# EAGLE design Motor_Controller (EAGLE 7.7.0)
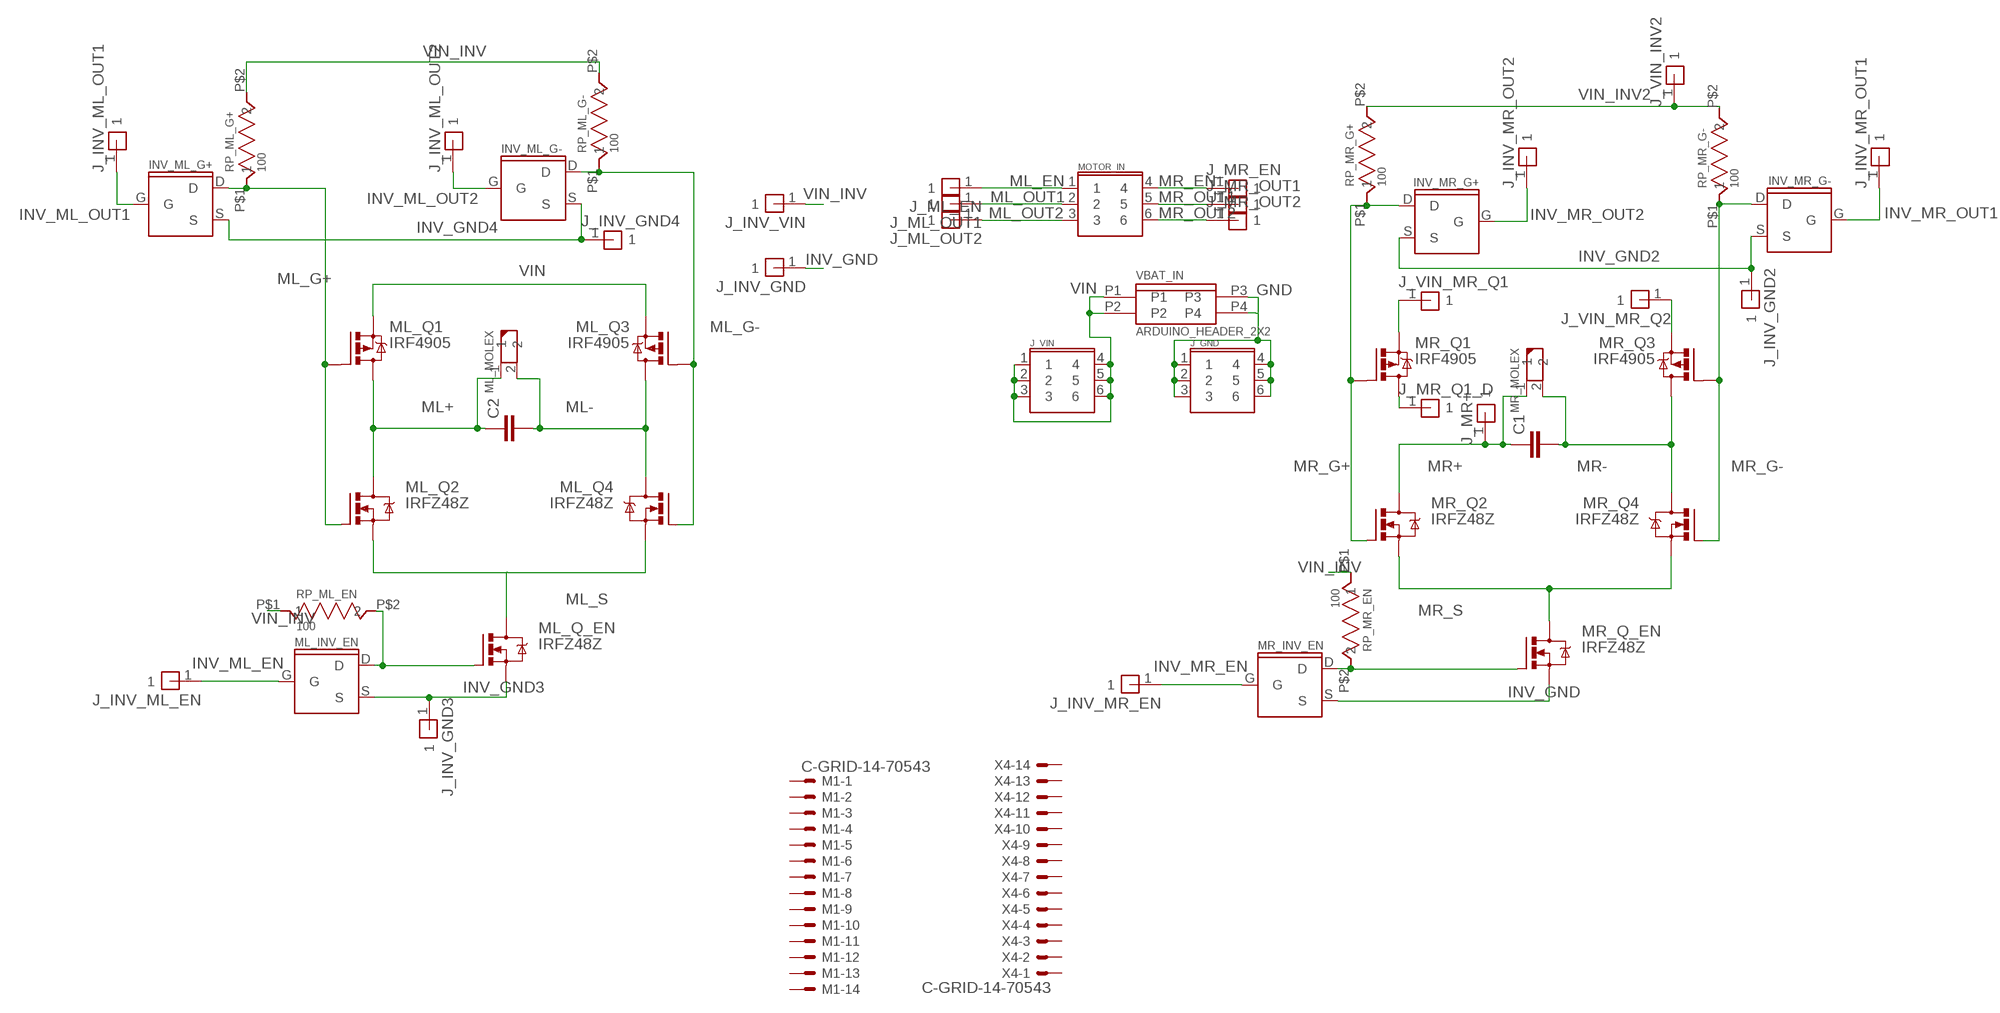
[diagram p0: schematic, sheet 1]

## Parts
C1  C5/3  [C5B3]
C2  C5/3  [C5B3]
INV_ML_G+  2N7000  [TO-92]
INV_ML_G-  2N7000  [TO-92]
INV_MR_G+  2N7000  [TO-92]
INV_MR_G-  2N7000  [TO-92]
J_GND  ARDUINO_HEADER_3X2  [ARDUINO_HEADER_3X2]
J_INV_GND  ARDUINO_HEADER_1X1_OCTAGON  [ARDUINO_HEADER_1X1_OCTAGON]
J_INV_GND2  ARDUINO_HEADER_1X1_OCTAGON  [ARDUINO_HEADER_1X1_OCTAGON]
J_INV_GND3  ARDUINO_HEADER_1X1_OCTAGON  [ARDUINO_HEADER_1X1_OCTAGON]
J_INV_GND4  ARDUINO_HEADER_1X1_OCTAGON  [ARDUINO_HEADER_1X1_OCTAGON]
J_INV_ML_EN  ARDUINO_HEADER_1X1_OCTAGON  [ARDUINO_HEADER_1X1_OCTAGON]
J_INV_ML_OUT1  ARDUINO_HEADER_1X1_OCTAGON  [ARDUINO_HEADER_1X1_OCTAGON]
J_INV_ML_OUT2  ARDUINO_HEADER_1X1_OCTAGON  [ARDUINO_HEADER_1X1_OCTAGON]
J_INV_MR_EN  ARDUINO_HEADER_1X1_OCTAGON  [ARDUINO_HEADER_1X1_OCTAGON]
J_INV_MR_OUT1  ARDUINO_HEADER_1X1_OCTAGON  [ARDUINO_HEADER_1X1_OCTAGON]
J_INV_MR_OUT2  ARDUINO_HEADER_1X1_OCTAGON  [ARDUINO_HEADER_1X1_OCTAGON]
J_INV_VIN  ARDUINO_HEADER_1X1_OCTAGON  [ARDUINO_HEADER_1X1_OCTAGON]
J_ML_EN  ARDUINO_HEADER_1X1_OCTAGON  [ARDUINO_HEADER_1X1_OCTAGON]
J_ML_OUT1  ARDUINO_HEADER_1X1_OCTAGON  [ARDUINO_HEADER_1X1_OCTAGON]
J_ML_OUT2  ARDUINO_HEADER_1X1_OCTAGON  [ARDUINO_HEADER_1X1_OCTAGON]
J_MR+  ARDUINO_HEADER_1X1_OCTAGON  [ARDUINO_HEADER_1X1_OCTAGON]
J_MR_EN  ARDUINO_HEADER_1X1_OCTAGON  [ARDUINO_HEADER_1X1_OCTAGON]
J_MR_OUT1  ARDUINO_HEADER_1X1_OCTAGON  [ARDUINO_HEADER_1X1_OCTAGON]
J_MR_OUT2  ARDUINO_HEADER_1X1_OCTAGON  [ARDUINO_HEADER_1X1_OCTAGON]
J_MR_Q1_D  ARDUINO_HEADER_1X1_OCTAGON  [ARDUINO_HEADER_1X1_OCTAGON]
J_VIN  ARDUINO_HEADER_3X2  [ARDUINO_HEADER_3X2]
J_VIN_INV2  ARDUINO_HEADER_1X1_OCTAGON  [ARDUINO_HEADER_1X1_OCTAGON]
J_VIN_MR_Q1  ARDUINO_HEADER_1X1_OCTAGON  [ARDUINO_HEADER_1X1_OCTAGON]
J_VIN_MR_Q2  ARDUINO_HEADER_1X1_OCTAGON  [ARDUINO_HEADER_1X1_OCTAGON]
M1  C-GRID-14-70543  [70543-14]
ML_INV_EN  2N7000  [TO-92]
ML_MOLEX  MOLEX_2_PIN  [MOLEX_2_PIN]
ML_Q1  IRF4905  [TO220BH]
ML_Q2  IRFZ48Z  [TO220BH]
ML_Q3  IRF4905  [TO220BH]
ML_Q4  IRFZ48Z  [TO220BH]
ML_Q_EN  IRFZ48Z  [TO220BH]
MOTOR_IN  ARDUINO_HEADER_3X2  [ARDUINO_HEADER_3X2]
MR_INV_EN  2N7000  [TO-92]
MR_MOLEX  MOLEX_2_PIN  [MOLEX_2_PIN]
MR_Q1  IRF4905  [TO220BH]
MR_Q2  IRFZ48Z  [TO220BH]
MR_Q3  IRF4905  [TO220BH]
MR_Q4  IRFZ48Z  [TO220BH]
MR_Q_EN  IRFZ48Z  [TO220BH]
RP_ML_EN  100  RESISTOR_THROUGH_8MM  [RESISTOR_THROUGH_8MM]
RP_ML_G+  100  RESISTOR_THROUGH_8MM  [RESISTOR_THROUGH_8MM]
RP_ML_G-  100  RESISTOR_THROUGH_8MM  [RESISTOR_THROUGH_8MM]
RP_MR_EN  100  RESISTOR_THROUGH_8MM  [RESISTOR_THROUGH_8MM]
RP_MR_G+  100  RESISTOR_THROUGH_8MM  [RESISTOR_THROUGH_8MM]
RP_MR_G-  100  RESISTOR_THROUGH_8MM  [RESISTOR_THROUGH_8MM]
VBAT_IN  ARDUINO_HEADER_2X2  [ARDUINO_HEADER_2X2]
X4  C-GRID-14-70543  [70543-14]

## Nets
GND: J_GND.1 J_GND.2 J_GND.3 J_GND.4 J_GND.5 J_GND.6 VBAT_IN.P3 VBAT_IN.P4
INV_GND: J_INV_GND.1 MR_INV_EN.S MR_Q_EN.S
INV_GND2: INV_MR_G+.S INV_MR_G-.S J_INV_GND2.1
INV_GND3: J_INV_GND3.1 ML_INV_EN.S ML_Q_EN.S
INV_GND4: INV_ML_G+.S INV_ML_G-.S J_INV_GND4.1
INV_ML_EN: J_INV_ML_EN.1 ML_INV_EN.G
INV_ML_OUT1: INV_ML_G+.G J_INV_ML_OUT1.1
INV_ML_OUT2: INV_ML_G-.G J_INV_ML_OUT2.1
INV_MR_EN: J_INV_MR_EN.1 MR_INV_EN.G
INV_MR_OUT1: INV_MR_G-.G J_INV_MR_OUT1.1
INV_MR_OUT2: INV_MR_G+.G J_INV_MR_OUT2.1
ML+ [POWER]: C2.1 ML_MOLEX.1 ML_Q1.D ML_Q2.D
ML- [POWER]: C2.2 ML_MOLEX.2 ML_Q3.D ML_Q4.D
ML_EN: J_ML_EN.1 MOTOR_IN.1
ML_G+: INV_ML_G+.D ML_Q1.G ML_Q2.G RP_ML_G+.P$1
ML_G-: INV_ML_G-.D ML_Q3.G ML_Q4.G RP_ML_G-.P$1
ML_OUT1: J_ML_OUT1.1 MOTOR_IN.2
ML_OUT2: J_ML_OUT2.1 MOTOR_IN.3
ML_S: ML_Q2.S ML_Q4.S ML_Q_EN.D
MR+ [POWER]: C1.1 J_MR+.1 MR_MOLEX.1 MR_Q2.D
MR- [POWER]: C1.2 MR_MOLEX.2 MR_Q3.D MR_Q4.D
MR_EN: J_MR_EN.1 MOTOR_IN.4
MR_G+: INV_MR_G+.D MR_Q1.G MR_Q2.G RP_MR_G+.P$1
MR_G-: INV_MR_G-.D MR_Q3.G MR_Q4.G RP_MR_G-.P$1
MR_OUT1: J_MR_OUT1.1 MOTOR_IN.5
MR_OUT2: J_MR_OUT2.1 MOTOR_IN.6
MR_Q1_D: J_MR_Q1_D.1 MR_Q1.D
MR_S: MR_Q2.S MR_Q4.S MR_Q_EN.D
N$1: MR_INV_EN.D MR_Q_EN.G RP_MR_EN.P$2
N$2: ML_INV_EN.D ML_Q_EN.G RP_ML_EN.P$2
N$3: J_VIN_MR_Q1.1 MR_Q1.S
N$100: J_VIN_MR_Q2.1 MR_Q3.S
VIN: J_VIN.1 J_VIN.2 J_VIN.3 J_VIN.4 J_VIN.5 J_VIN.6 ML_Q1.S ML_Q3.S VBAT_IN.P1 VBAT_IN.P2
VIN_INV: J_INV_VIN.1 RP_ML_EN.P$1 RP_ML_G+.P$2 RP_ML_G-.P$2 RP_MR_EN.P$1
VIN_INV2: J_VIN_INV2.1 RP_MR_G+.P$2 RP_MR_G-.P$2
Unconnected: M1.1 M1.2 M1.3 M1.4 M1.5 M1.6 M1.7 M1.8 M1.9 M1.10 M1.11 M1.12 M1.13 M1.14 X4.1 X4.2 X4.3 X4.4 X4.5 X4.6 X4.7 X4.8 X4.9 X4.10 X4.11 X4.12 X4.13 X4.14

## Library data of the parts
C1 C2 = capacitor-wima:C: CAPACITOR naming: grid - package width
INV_ML_G+ INV_ML_G- INV_MR_G+ INV_MR_G- ML_INV_EN MR_INV_EN = ben_kramer:2N7000
J_GND J_VIN MOTOR_IN = ben_kramer:ARDUINO_HEADER_3X2
J_INV_GND J_INV_GND2-J_INV_GND4 J_INV_ML_EN J_INV_ML_OUT1 J_INV_ML_OUT2 J_INV_MR_EN J_INV_MR_OUT1 J_INV_MR_OUT2 J_INV_VIN J_ML_EN J_ML_OUT1 J_ML_OUT2 J_MR+ J_MR_EN J_MR_OUT1 J_MR_OUT2 J_MR_Q1_D J_VIN_INV2 J_VIN_MR_Q1 J_VIN_MR_Q2 = ben_kramer:ARDUINO_HEADER_1X1_OCTAGON
M1 X4 = con-molex:C-GRID-14: CONNECTOR wire to board 2.54 mm (0.100") pitch header; OC_FARNELL: unknown; OC_NEWARK: unknown
ML_MOLEX MR_MOLEX = ben_kramer:MOLEX_2_PIN
ML_Q1 ML_Q3 MR_Q1 MR_Q3 = transistor-power:IRF4905: P-Channel HEXFET® Power MOSFET RDS(on)= 0.02 Ohm, ID = -74A Source: http://www.irf.com/product-info/datasheets/data/irf4905pbf.pdf
ML_Q2 ML_Q4 ML_Q_EN MR_Q2 MR_Q4 MR_Q_EN = transistor-power:IRFZ48: N Channel HEXFET® Power MOSFET Logic Level Source: http://www.irf.com/product-info/datasheets/data/irfz48z.pdf
RP_ML_EN RP_ML_G+ RP_ML_G- RP_MR_EN RP_MR_G+ RP_MR_G- = ben_kramer:RESISTOR_THROUGH_8MM
VBAT_IN = ben_kramer:ARDUINO_HEADER_2X2

## Net classes
0 default: width 0.406 mm, clearance 0.254 mm
1 POWER: width 0.61 mm, clearance 0.254 mm

## Board
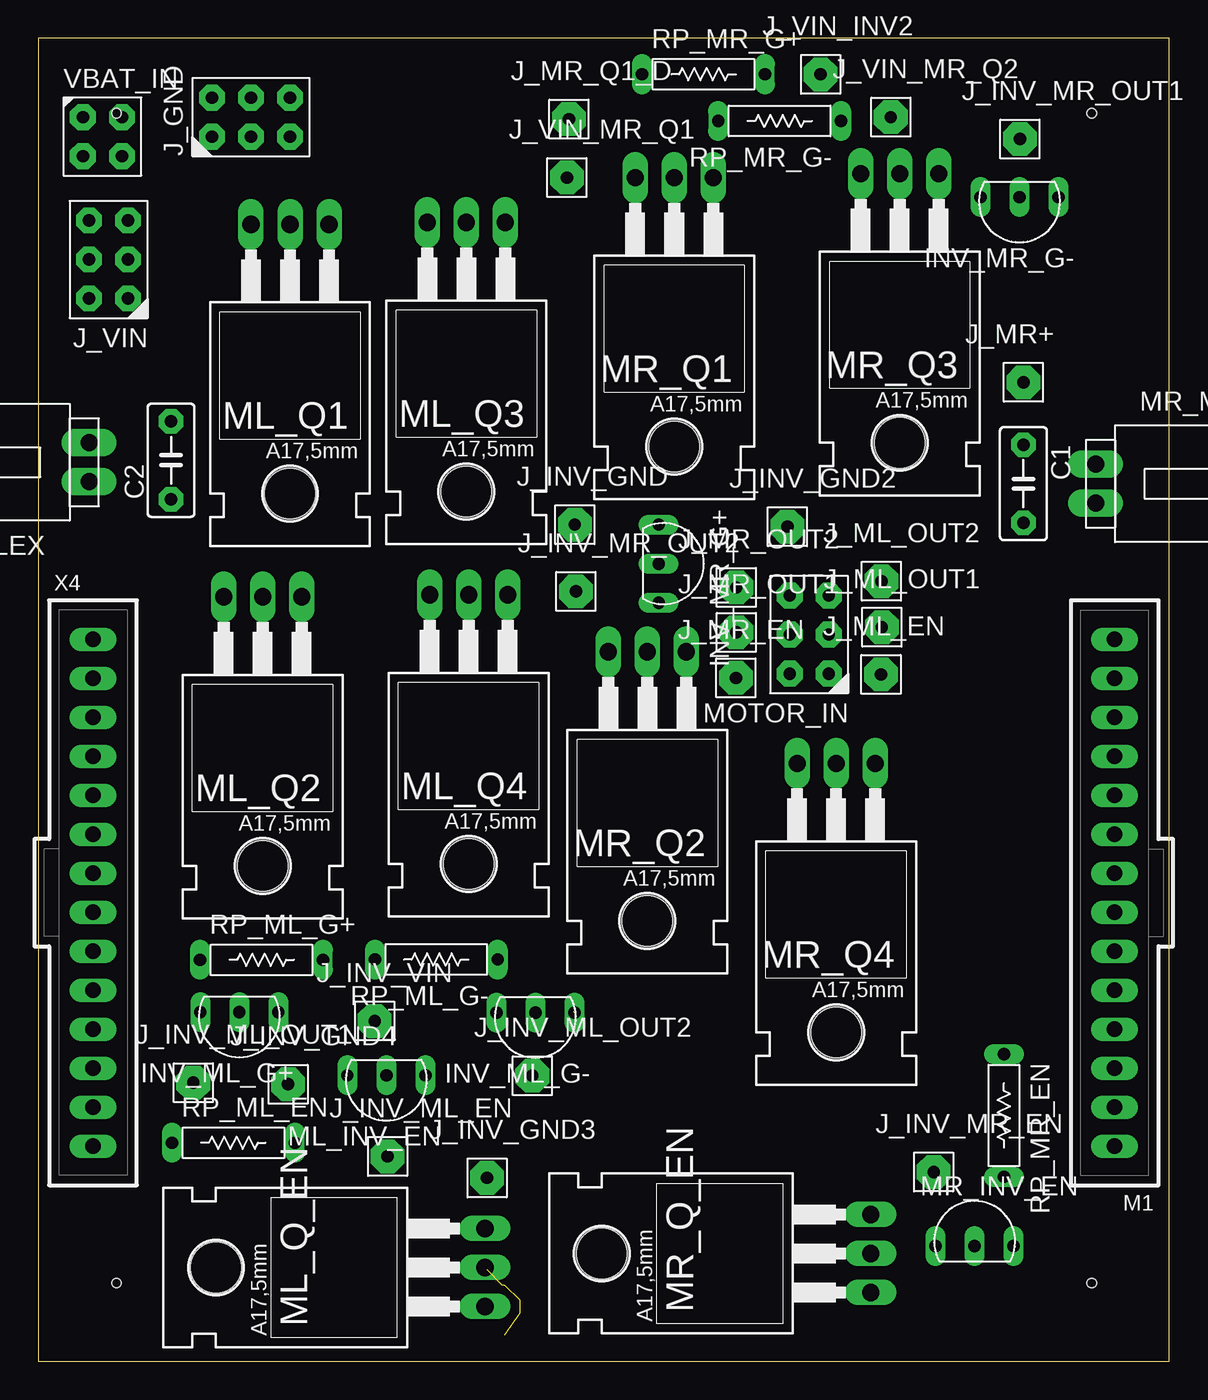
[diagram p1: board, top side]
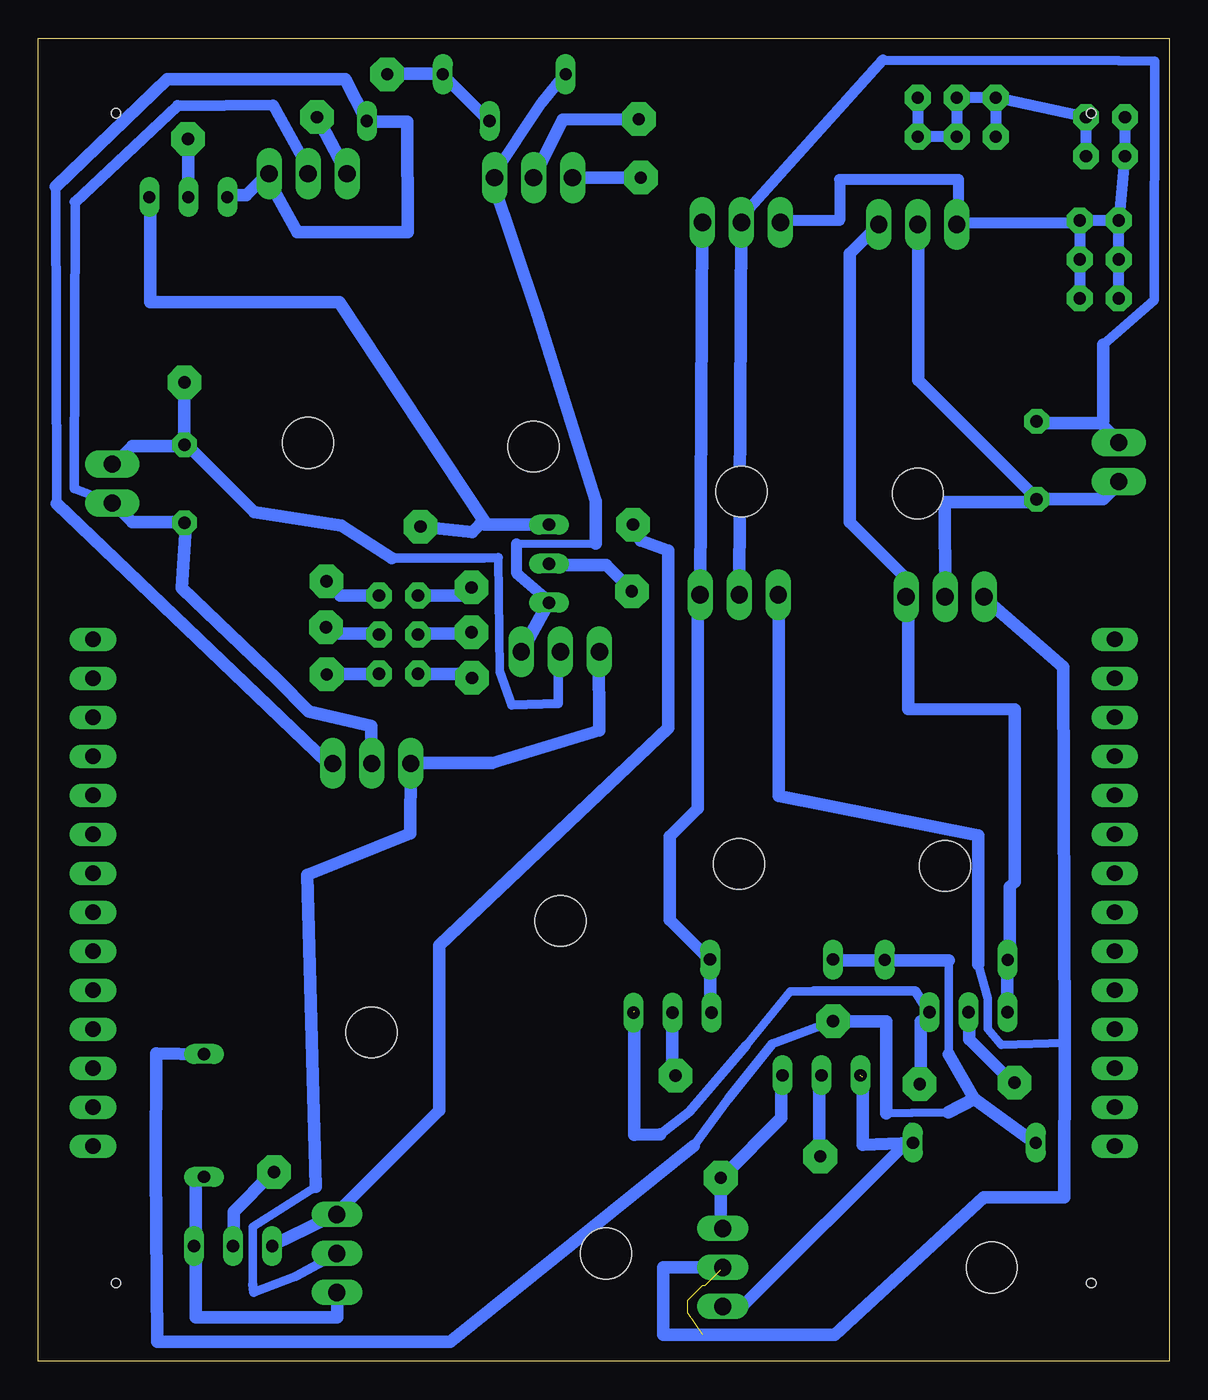
[diagram p2: board, bottom side, seen from below]

Size 73.64 x 86.16 mm. Coordinates in mm from the lower left corner, seen from the top.
Outline: 0,0 73.64,0 73.64,86.16 0,86.16 0,0
Copper layers (1*16): Top 0.035mm / dielectric 1.5mm / Bottom 0.035mm
Design rules "default": minimum track width 10mil, minimum drill 24mil, track to track 8mil, track to pad 8mil, pad to pad 8mil, via to via 8mil, smd to smd 8mil, copper to edge 40mil, drill to drill 8mil, minimum pad ring 10mil, minimum via ring 8mil, stop-mask expansion 4mil, vias tented up to drill 0mil, thermal gap 10mil
Holes 0.6 mm at 5.08,5.08 68.58,5.08 5.08,81.28 68.58,81.28

### Footprints (pad centres in the part's own frame; a part is rotated, then mirrored left to right if it is on the bottom)
C5B3 = drill 0.813 pad 1.6 octagon: 1 -2.54,0; 2 2.54,0
TO-92 = drill 0.8 pad 1.27 long: D 2.54,0; G 0,0; S -2.54,0
ARDUINO_HEADER_3X2 = drill 0.8 pad 1.676 octagon: 1 -1.27,2.54; 2 -1.27,0; 3 -1.27,-2.54; 4 1.27,2.54; 5 1.27,0; 6 1.27,-2.54
ARDUINO_HEADER_1X1_OCTAGON = drill 0.8 pad 2.184 octagon: 1 0,0
70543-14 = drill 1.016 long: 1 -16.51,0; 2 -13.97,0; 3 -11.43,0; 4 -8.89,0; 5 -6.35,0; 6 -3.81,0; 7 -1.27,0; 8 1.27,0; 9 3.81,0; 10 6.35,0; 11 8.89,0; 12 11.43,0; 13 13.97,0; 14 16.51,0
MOLEX_2_PIN = drill 1.1 pad 1.778 long: 1 -1.27,-6.35; 2 1.27,-6.35
TO220BH = drill 1.118 long: D 0,-6.35; G -2.54,-6.35; S 2.54,-6.35 | hole 3.302: 0,11.176
RESISTOR_THROUGH_8MM = drill 0.8 long: P$1 -4,0; P$2 4,0
ARDUINO_HEADER_2X2 = drill 0.8 pad 1.676 octagon: P1 -1.27,1.27; P2 -1.27,-1.27; P3 1.27,1.27; P4 1.27,-1.27

### Placement (x,y rotation side)
C1  64.14,57.15 270 top
C2  8.64,58.67 90 top
INV_ML_G+  13.08,22.73 180 top
INV_ML_G-  32.36,22.71 180 top
INV_MR_G+  40.39,51.94 270 top
INV_MR_G-  63.88,75.82 180 top
J_GND  13.84,81.03 90 top
J_INV_GND  34.92,54.48 0 top
J_INV_GND2  48.77,54.36 0 top
J_INV_GND3  29.21,11.94 0 top
J_INV_GND4  16.26,18.03 0 top
J_INV_ML_EN  22.73,13.34 0 top
J_INV_ML_OUT1  10.08,18.14 0 top
J_INV_ML_OUT2  32.16,18.59 0 top
J_INV_MR_EN  58.29,12.32 0 top
J_INV_MR_OUT1  63.91,79.6 0 top
J_INV_MR_OUT2  35,50.14 0 top
J_INV_VIN  21.89,22.15 0 top
J_ML_EN  54.86,44.73 0 top
J_ML_OUT1  54.91,47.8 0 top
J_ML_OUT2  54.89,50.8 0 top
J_MR+  64.14,63.75 0 top
J_MR_EN  45.42,44.5 0 top
J_MR_OUT1  45.44,47.47 0 top
J_MR_OUT2  45.44,50.39 0 top
J_MR_Q1_D  34.54,80.9 0 top
J_VIN  4.57,71.75 180 top
J_VIN_INV2  50.93,83.82 0 top
J_VIN_MR_Q1  34.42,77.09 0 top
J_VIN_MR_Q2  55.5,81.03 0 top
M1  70.08,30.51 90 top
ML_INV_EN  22.66,18.62 180 top
ML_MOLEX  -3.05,58.55 90 top
ML_Q1  16.38,67.69 180 top
ML_Q2  14.61,43.43 180 top
ML_Q3  27.86,67.82 180 top
ML_Q4  28.02,43.56 180 top
ML_Q_EN  22.73,6.1 90 top
MOTOR_IN  50.19,47.32 180 top
MR_INV_EN  60.96,7.49 0 top
MR_MOLEX  75.18,57.15 270 top
MR_Q1  41.4,70.74 180 top
MR_Q2  39.65,39.85 180 top
MR_Q3  56.08,70.99 180 top
MR_Q4  51.94,32.59 180 top
MR_Q_EN  47.85,7.01 90 top
RP_ML_EN  12.7,14.22 0 top
RP_ML_G+  14.53,26.14 0 top
RP_ML_G-  25.91,26.16 180 top
RP_MR_EN  62.87,16 270 top
RP_MR_G+  43.31,83.82 0 top
RP_MR_G-  48.26,80.77 180 top
VBAT_IN  4.17,79.76 0 top
X4  3.56,30.51 270 top

### Tracks (layer width: path | path; a pad name or v marks a point on that pad's centre or on a via)
GND
  Bottom 0.406: 16.34,79.74 J_GND.3 | 14.03,79.74 J_GND.2
  Bottom 0.711: VBAT_IN.P4 VBAT_IN.P3 J_GND.4 | J_GND.4 J_GND.1 | J_GND.4 J_GND.5 J_GND.2 | J_GND.6 J_GND.3 | 14.03,79.74 16.34,79.74
INV_GND
  Bottom 0.406: 58.28,7.59 MR_INV_EN.S | 54.32,9.58 MR_Q_EN.S 54.15,9.74
  Bottom 0.813: 58.28,7.59 56.15,8.64 54.32,9.58 | 54.15,9.74 47.55,16.34 47.55,27.08 32.64,41.22 32.64,52.78 34.42,53.44 J_INV_GND.1
INV_GND2
  Bottom 0.406: 44.91,54.48 44.58,54.48 44.58,54.65 | 66.37,75.78 INV_MR_G-.S
  Bottom 0.813: 44.58,54.48 INV_MR_G+.S | 44.91,54.48 45.4,53.99 J_INV_GND2.1 | 66.37,75.78 66.36,68.99 54.06,68.96 44.58,54.65
INV_GND3
  Bottom 0.406: 25.26,18.49 ML_INV_EN.S | 29.06,12.05 J_INV_GND3.1 29.22,11.89 | 29.22,8.75 ML_Q_EN.S
  Bottom 0.813: 25.26,18.49 25.26,15.85 29.06,12.05 | 29.22,11.89 29.22,8.75
INV_GND4  (1 unrouted)
  Bottom 0.406: 23.15,24.11 23.25,24.08 | 15.68,22.78 INV_ML_G+.S 15.68,22.62 | 16.18,18.16 J_INV_GND4.1
  Bottom 0.559: 23.25,24.08 24.69,24.08 27.56,20.57
  Bottom 0.61: 23.15,24.11 16.55,24.11 15.68,22.78 | 15.68,22.62 16.18,22.12 | 33.15,14.78 31.27,16.23 27.56,20.57
  Bottom 0.813: 16.18,22.12 16.18,18.16 | 34.84,22.78 34.85,14.73 33.15,14.78
INV_ML_EN
  Bottom 0.406: 22.78,13.37 J_INV_ML_EN.1
  Bottom 0.813: 22.78,13.37 22.78,18.49 ML_INV_EN.G
INV_ML_OUT1
  Bottom 0.406: 13.04,22.62 INV_ML_G+.G
  Bottom 0.813: 13.04,22.62 13.04,20.97 10.24,18.16 J_INV_ML_OUT1.1
INV_ML_OUT2
  Bottom 0.406: 32.19,18.66 J_INV_ML_OUT2.1
  Bottom 0.813: INV_ML_G-.G 32.36,18.82 32.19,18.66
INV_MR_EN
  Bottom 0.406: 60.92,7.59 MR_INV_EN.G | 58.45,12.22 J_INV_MR_EN.1
  Bottom 0.813: 60.92,7.59 60.92,9.74 58.45,12.22
INV_MR_OUT1
  Bottom 0.406: 63.89,75.95 INV_MR_G-.G | 63.89,79.58 J_INV_MR_OUT1.1
  Bottom 0.813: 63.89,79.58 63.89,75.95
INV_MR_OUT2
  Bottom 0.406: 40.28,51.84 INV_MR_G+.G | 35,50.19 J_INV_MR_OUT2.1
  Bottom 0.813: 40.28,51.84 36.65,51.84 35,50.19
ML+
  Bottom 0.61: 3.3,57.12 ML_MOLEX.1 | 8.75,55.97 C2.1 8.75,56.3 | 16.34,73.97 ML_Q1.D
  Bottom 0.813: C2.1 4.29,56.13 3.3,57.12 | 16.34,73.97 16.34,63.89 8.75,56.3 | 8.75,55.97 14.63,55.96 ML_Q2.D
ML-
  Bottom 0.61: 8.59,61.09 C2.2 | 3.3,59.93 ML_MOLEX.2 | 27.74,73.64 27.74,74.13 ML_Q3.D 27.9,74.46 | 4.29,66.2 0.98,69.11 0.95,84.67 3.29,84.7 18.66,84.75 | 4.29,61.25 4.46,61.09
  Bottom 0.711: 27.9,74.46 18.66,84.75
  Bottom 0.813: 8.59,61.09 4.46,61.09 3.3,59.93 | 4.29,66.2 4.29,61.25 | ML_Q4.D ML_Q3.D
ML_EN
  Bottom 0.406: 51.51,44.74 MOTOR_IN.1 | 54.81,44.74 J_ML_EN.1
  Bottom 0.813: 54.81,44.74 51.51,44.74
ML_G+
  Bottom 0.406: 10.57,26.09 RP_ML_G+.P$1 10.4,26.25 | 10.57,22.78 INV_ML_G+.D | 17.17,49.86 ML_Q2.G 17,49.7 | 18.99,73.97 ML_Q1.G
  Bottom 0.813: 10.57,22.78 10.57,26.09 | 17.17,49.86 17.17,51.02 20.8,54.65 20.8,72.15 18.99,73.97 | 10.4,26.25 10.4,30.87 10.07,31.2 10.07,42.43 17,42.48 17,49.7
ML_G-
  Bottom 0.406: 29.88,22.78 INV_ML_G-.D | 29.88,26.09 RP_ML_G-.P$1 30.05,26.25 | 30.71,49.86 ML_Q4.G
  Bottom 0.813: 29.88,26.09 29.88,22.78 | 30.71,49.86 30.71,35.99 32.52,34.18 32.52,28.73 30.05,26.25 | ML_Q3.G ML_Q4.G
ML_OUT1
  Bottom 0.406: 51.51,47.38 MOTOR_IN.2
  Bottom 0.813: 51.51,47.38 54.48,47.38 54.81,47.71 J_ML_OUT1.1
ML_OUT2
  Bottom 0.813: MOTOR_IN.3 53.99,49.86 54.81,50.69 J_ML_OUT2.1
ML_S  (5 unrouted)
  Bottom 0.406: 12.05,49.7 ML_Q2.S | 25.43,49.86 ML_Q4.S
  Bottom 0.559: 12.43,25.84 11.82,23.64 11.82,21.65 10.96,20.59 6.82,20.71
  Bottom 0.813: 12.05,49.7 6.92,45.2 6.82,20.71 6.84,10.67 8.31,10.65 12.09,10.65 21.79,1.71 30.38,1.71 32.97,1.73 32.97,6.12 ML_Q_EN.D | 25.43,49.86 25.43,36.82 12.45,34.23 12.43,25.84
MR+
  Bottom 0.559: 42.81,42.75 43.6,44.93 43.7,52.35
  Bottom 0.61: 64.22,59.6 C1.1 63.89,59.6 | 68.68,58.45 MR_MOLEX.1 | 42.81,42.75 39.8,42.85 39.79,45.73 39.79,46.06 MR_Q2.D | 43.7,52.35 44.62,52.3 50.65,52.3
  Bottom 0.813: 64.22,59.6 67.53,59.6 68.68,58.45 | 50.65,52.3 53.91,54.42 59.6,55.31 63.89,59.6 | J_MR+.1 C1.1
MR-
  Bottom 0.61: 64.22,54.65 C1.2 64.06,54.32 | 68.68,55.8 MR_MOLEX.2 69.01,56.13 69.51,56.13 71.3,56.83 71.25,75.49 | 52.01,38.96 MR_Q4.D | 56.13,77.43 MR_Q3.D
  Bottom 0.711: 56.13,77.43 56.13,77.76 58.37,81.83 64.58,81.78 71.25,75.49
  Bottom 0.813: 64.22,54.65 67.53,54.65 68.68,55.8 | 52.01,38.96 51.96,41.36 56.03,42.33 58.09,44.4 64.31,50.37 64.06,54.32
MR_EN
  Bottom 0.406: 45.57,44.58 45.73,44.74 | 48.87,44.74 MOTOR_IN.4
  Bottom 0.813: 45.73,44.74 48.87,44.74 | 45.57,44.58 J_MR_EN.1
MR_G+
  Bottom 0.406: 40.45,49.37 INV_MR_G+.D 40.45,49.53 | 39.46,83.71 RP_MR_G+.P$1 | 44.08,77.1 MR_Q1.G 44.08,76.94
  Bottom 0.559: 37.34,53.25 42.52,53.23
  Bottom 0.711: 39.46,83.71 40.86,81.98 44.08,77.1 | 40.45,49.53 42.52,51.35 42.52,53.23
  Bottom 0.813: 37.34,53.25 37.36,56.02 41.17,68.19 44.08,76.94 | 40.45,49.37 MR_Q2.G
MR_G-
  Bottom 0.406: 58.78,77.27 MR_Q3.G 58.78,77.1 | 52.17,80.73 RP_MR_G-.P$1 52.34,80.9 | 54.81,38.96 54.48,38.96 MR_Q4.G
  Bottom 0.61: 72.5,76.5 72.45,55.84
  Bottom 0.813: 58.78,77.27 60.1,75.95 61.25,75.95 INV_MR_G-.D | 52.17,80.73 49.63,80.72 49.59,73.55 56.79,73.55 58.78,77.1 | 72.45,55.84 54.81,38.96 | 72.5,76.5 65.27,83.49 53.66,83.49 52.34,80.9
MR_OUT1
  Bottom 0.406: 48.87,47.38 MOTOR_IN.5 | 45.57,47.38 J_MR_OUT1.1
  Bottom 0.813: 45.57,47.38 48.87,47.38
MR_OUT2
  Bottom 0.406: 45.57,50.35 J_MR_OUT2.1
  Bottom 0.813: MOTOR_IN.6 46.06,49.86 45.57,50.35
MR_Q1_D
  Bottom 0.813: MR_Q1.D 39.5,80.85 J_MR_Q1_D.1
MR_S
  Bottom 0.406: 54.32,6.93 MR_Q_EN.D | 37.11,41.08 37.11,41.25 | 37.15,46.06 MR_Q2.S | 49.2,38.96 MR_Q4.S
  Bottom 0.559: 59.69,5 59.68,6.44 59.68,8.75 55.58,11.35
  Bottom 0.61: 54.32,6.93 56.88,5.54 59.63,4.5 59.69,5
  Bottom 0.813: 55.58,11.35 56.13,31.67 49.42,34.35 MR_Q4.S | 37.11,41.25 37.15,46.06 | 37.11,41.08 44.08,38.96 49.2,38.96
N$1
  Bottom 0.406: 63.4,11.39 62.9,11.89 RP_MR_EN.P$2 | 63.4,7.59 MR_INV_EN.D 63.4,7.43
  Bottom 0.813: 63.4,11.39 63.4,7.59 | 63.4,7.43 63.39,2.85 54.19,2.85 MR_Q_EN.G
N$2  (1 unrouted)
  Bottom 0.406: 16.84,15.35 16.84,14.36 RP_ML_EN.P$2 17,14.36 | 27.74,3.63 29.06,3.63 ML_Q_EN.G
  Bottom 0.813: 17,14.36 27.74,3.63 | 19.98,18.49 19.96,14.07 RP_ML_EN.P$2
N$3
  Bottom 0.813: J_VIN_MR_Q1.1 MR_Q1.S
N$100
  Bottom 0.813: J_VIN_MR_Q2.1 MR_Q3.S
VIN
  Bottom 0.406: J_VIN.2 5.84,71.88 | 13.7,74.13 ML_Q1.S 13.7,74.3 | 5.94,74.13 J_VIN.3 | 25.26,74.3 ML_Q3.S
  Bottom 0.711: VBAT_IN.P1 VBAT_IN.P2 J_VIN.6 | J_VIN.6 J_VIN.3 J_VIN.2 J_VIN.1 | J_VIN.6 J_VIN.5 J_VIN.4 | 5.94,74.13 13.7,74.13 | 25.26,74.3 21.46,74.3 21.46,76.96 13.73,76.96 13.7,74.3
VIN_INV
  Bottom 0.406: 8.65,14.11 RP_ML_EN.P$1 | 18.49,26.09 RP_ML_G+.P$2 18.66,26.09 | 21.79,26.09 RP_ML_G-.P$2 | 62.9,19.98 RP_MR_EN.P$1 | 21.96,22.12 J_INV_VIN.1 21.79,22.12
  Bottom 0.559: 14.36,26.09 14.36,19.98 | 14.4,16.22 16.79,16.17 18.43,16.15
  Bottom 0.61: 30.96,14.03 28.73,17.08 25.84,20.65 21.96,22.12
  Bottom 0.813: 14.36,19.98 12.69,17.09 | 12.69,17.09 8.65,14.11 | 14.36,26.09 16.68,26.09 18.49,26.09 | 18.66,26.09 21.79,26.09 | 62.9,19.98 65.98,20.04 66.02,12.64 65.91,1.26 46.81,1.26 30.96,14.03 | 14.4,16.22 12.69,17.09 | 18.43,16.15 18.43,22.12 21.79,22.12
VIN_INV2
  Bottom 0.406: 44.41,80.9 RP_MR_G-.P$2 | 47.22,83.71 RP_MR_G+.P$2 47.38,83.87 | 50.85,83.87 J_VIN_INV2.1
  Bottom 0.813: 47.22,83.71 44.41,80.9 | 47.38,83.87 50.85,83.87